# Altium project MaterBoard.PrjPcb
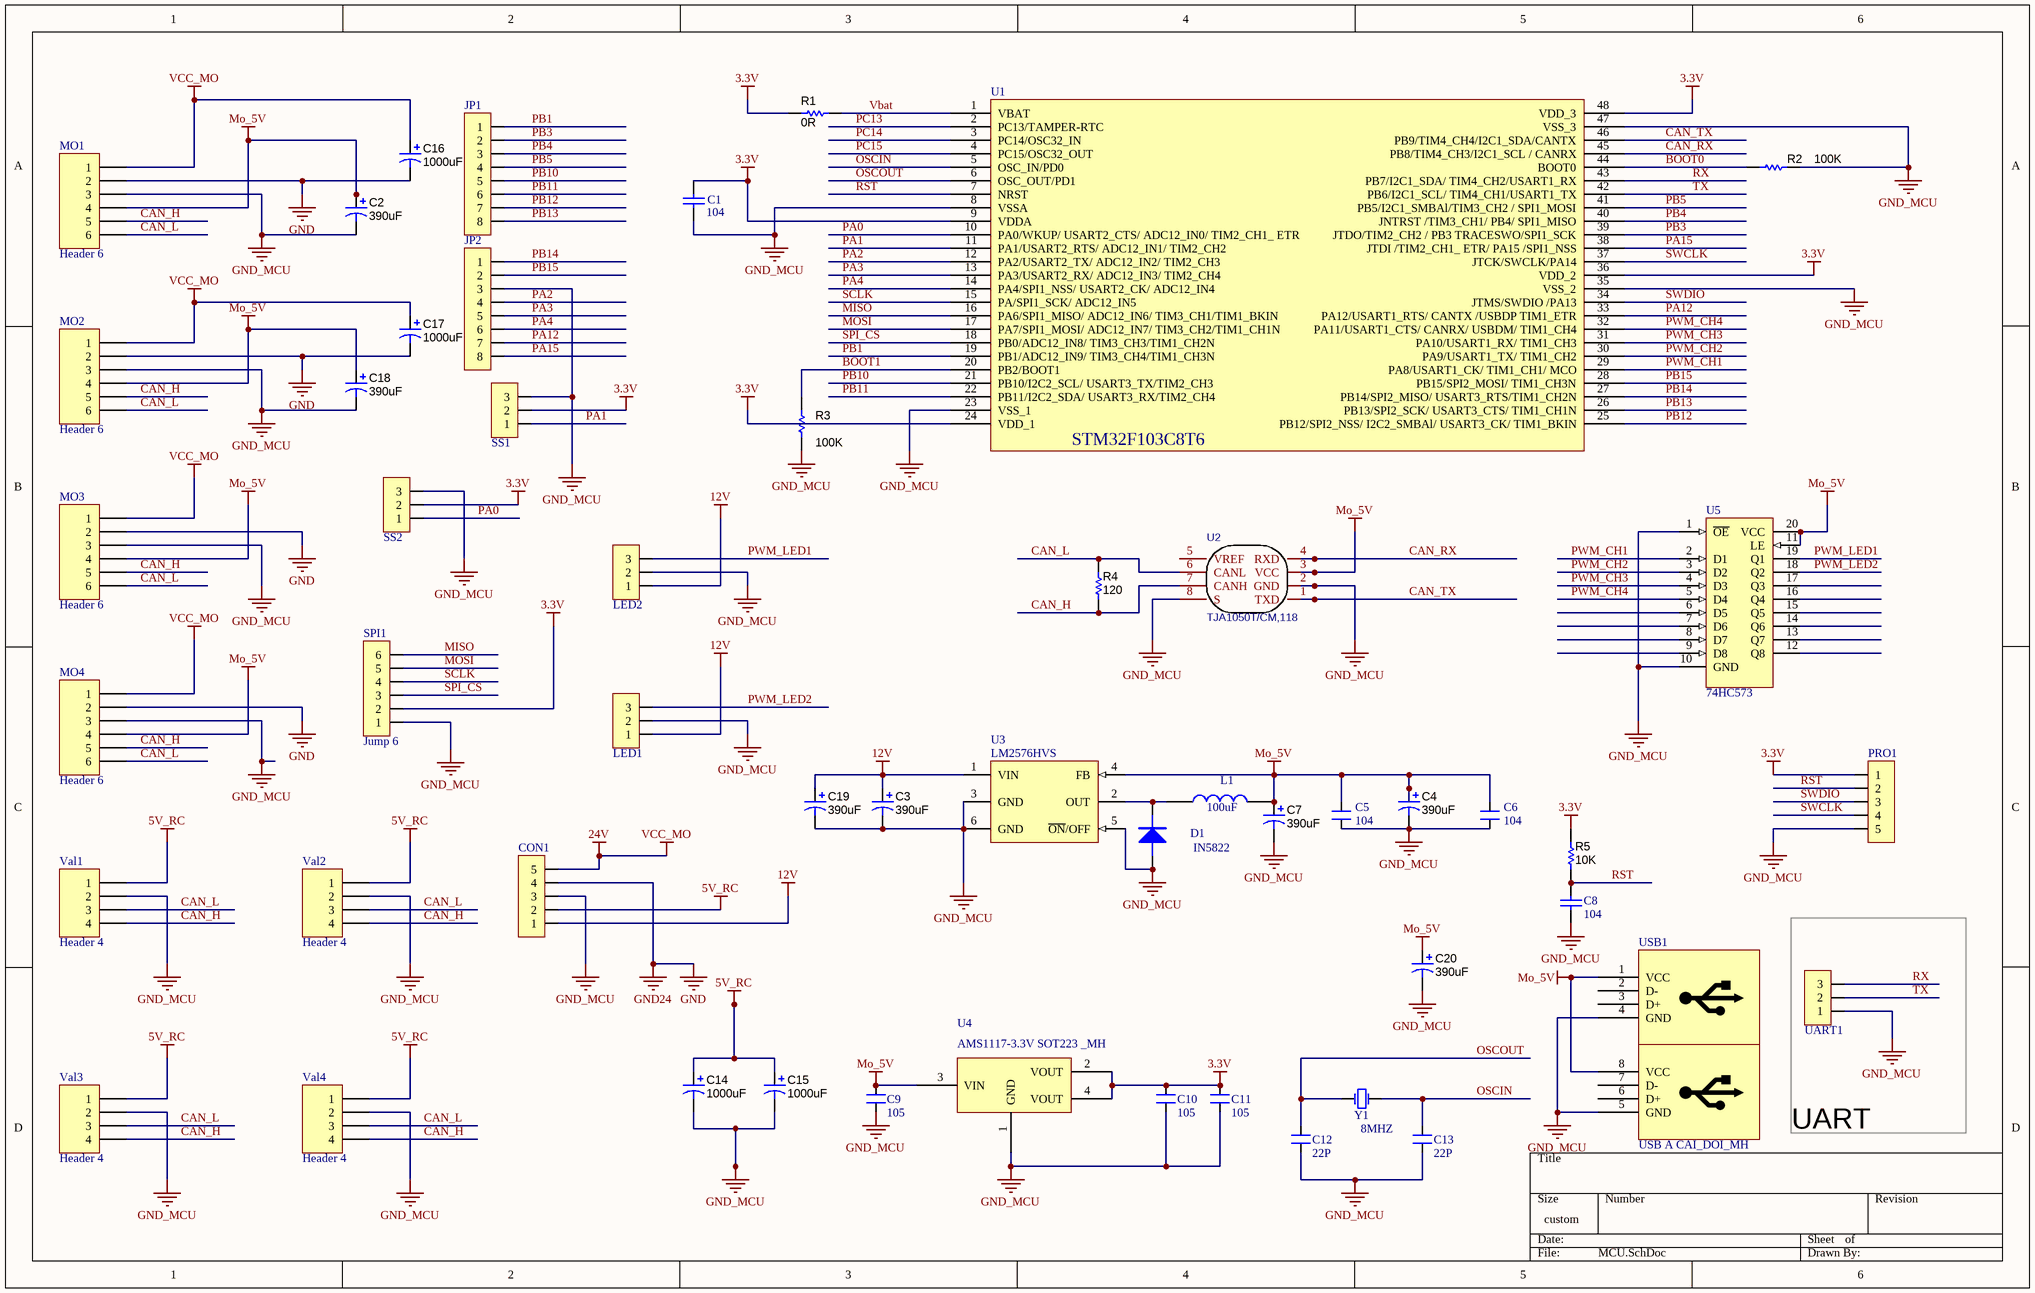
[diagram p0: MCU.SchDoc]
1 sheet, 52 parts. Net scope: global (net labels, ports and power ports of the same name join across sheets).
Board file: MasterPcb.PcbDoc

## Sheet MCU.SchDoc
size 381 x 241 mm

### Parts
C1  104  [0805_HV]
C2  390uF  [CP1/3.0]
C3  390uF  [CP1/3.0]
C4  390uF  [CP1/3.0]
C5  104  [0805_HV]
C6  104  [0805_HV]
C7  390uF  [CP1/3.0]
C8  104  [0805_HV]
C9  105  [0805_HV]
C10  105  [0805_HV]
C11  105  [0805_HV]
C12  22P  [0805_HV]
C13  22P  [0805_HV]
C14  ValueDisplayed: 1000uF  [CAP_12.5 X 25]  (hidden comment: 390uF)
C15  ValueDisplayed: 1000uF  [CAP_12.5 X 25]  (hidden comment: 390uF)
C16  ValueDisplayed: 1000uF  [CAP_12.5 X 25]  (hidden comment: 390uF)
C17  ValueDisplayed: 1000uF  [CAP_12.5 X 25]  (hidden comment: 390uF)
C18  390uF  [CP1/3.0]
C19  390uF  [CP1/3.0]
C20  390uF  [CP1/3.0]
CON1  CON 5 EDG 5.08_MH  [Con 5 EDG 5.08]  (value not drawn)
D1  IN5822  [SOD123]
JP1  Jump 8_MH  [Jump 8]  (value not drawn)
JP2  Jump 8_MH  [Jump 8]  (value not drawn)
L1  100uF  [IND_2118-V-RC]
LED1  Header 3_MH  [HEADER 3]  (value not drawn)
LED2  Header 3_MH  [HEADER 3]  (value not drawn)
MO1  Header 6  [HEADER 6]
MO2  Header 6  [HEADER 6]
MO3  Header 6  [HEADER 6]
MO4  Header 6  [HEADER 6]
PRO1  Header 5_MH  [HEADER 5]  (value not drawn)
R1  0R  [0805_HV]
R2  100K  [0805_HV]
R3  100K  [0805_HV]
R4  120  [0805_HV]
R5  10K  [0805_HV]
SPI1  Jump 6  [ZH 1.5 6P]
SS1  Header 3_MH  [HEADER 3]  (value not drawn)
SS2  Header 3_MH  [HEADER 3]  (value not drawn)
U1  STM32F103C8T6 LQFP48 _MH  [LQFP48]  (value not drawn)
U2  TJA1050T/CM,118  [SOP 8]
U3  LM2576HVS  [TO263-5]
U4  AMS1117-3.3V SOT223 _MH  [SOT223]
U5  74HC573  [SOIC-20]
UART1  Header 3_MH  [HEADER 3]  (value not drawn)
USB1  USB A CAI_DOI_MH  [USB_KEP]
Val1  Header 4  [JST-PH2.00-4P]
Val2  Header 4  [JST-PH2.00-4P]
Val3  Header 4  [JST-PH2.00-4P]
Val4  Header 4  [JST-PH2.00-4P]
Y1  8MHZ  [XT2]

### Blocks framed on the sheet
UART: UART1

### Nets
3.3V: C1.2 C10.2 C11.2 PRO1.1 R1.2 R5.2 SPI1.2 SS1.2 SS2.2 U1.9(VDDA) U1.24(VDD_1) U1.36(VDD_2) U1.48(VDD_3) U4.2(VOUT) U4.4(VOUT)
5V_RC: C14.1(+) C15.1(+) CON1.2 Val1.1 Val2.1 Val3.1 Val4.1
12V: C3.1(+) C19.1(+) CON1.1 LED1.1 LED2.1 U3.1(VIN)
24V: C16.1(+) C17.1(+) CON1.5 MO1.1 MO2.1 MO3.1 MO4.1  [also labelled VCC_MO]
GND: C16.2(-) C17.2(-) CON1.4 MO1.2 MO2.2 MO3.2 MO4.2  [also labelled GND24]
GND_MCU: C1.1 C2.2(-) C3.2(-) C4.2(-) C5.1 C6.1 C7.2(-) C8.1 C9.1 C10.1 C11.1 C12.1 C13.1 C14.2(-) C15.2(-) C18.2(-) C19.2(-) C20.2(-) CON1.3 D1.1 JP2.3 LED1.2 LED2.2 MO1.3 MO2.3 MO3.3 MO4.3 PRO1.5 R2.1 R3.2 SPI1.1 SS1.3 SS2.3 U1.8(VSSA) U1.23(VSS_1) U1.35(VSS_2) U1.47(VSS_3) U2.2(GND) U2.8(S) U3.3(GND) U3.5(~{ON}/OFF) U3.6(GND) U4.1(GND) U5.1(~{OE}) U5.10(GND) UART1.1 USB1.4(GND) USB1.5(GND) Val1.2 Val2.2 Val3.2 Val4.2
Mo_5V: C2.1(+) C4.1(+) C5.2 C6.2 C7.1(+) C9.2 C18.1(+) C20.1(+) L1.2 MO1.4 MO2.4 MO3.4 MO4.4 U2.3(VCC) U3.4(FB) U4.3(VIN) U5.11(LE) U5.20(VCC) USB1.1(VCC) USB1.8(VCC)
BOOT0: R2.2 U1.44(BOOT0)
BOOT1: R3.1 U1.20(PB2/BOOT1)
CAN_H: MO1.5 MO2.5 MO3.5 MO4.5 R4.2 U2.7(CANH) Val1.4 Val2.4 Val3.4 Val4.4
CAN_L: MO1.6 MO2.6 MO3.6 MO4.6 R4.1 U2.6(CANL) Val1.3 Val2.3 Val3.3 Val4.3
CAN_RX: U1.45(PB8/TIM4_CH3/I2C1_SCL_/_CANRX) U2.4(RXD)
CAN_TX: U1.46(PB9/TIM4_CH4/I2C1_SDA/CANTX) U2.1(TXD)
MISO: SPI1.6 U1.16(PA6/SPI1_MISO/_ADC12_IN6/_TIM3_CH1/TIM1_BKIN)
MOSI: SPI1.5 U1.17(PA7/SPI1_MOSI/_ADC12_IN7/_TIM3_CH2/TIM1_CH1N)
OSCIN: C13.2 U1.5(OSC_IN/PD0) Y1.2(OSC2)
OSCOUT: C12.2 U1.6(OSC_OUT/PD1) Y1.1(OSC1)
PA0: SS2.1 U1.10(PA0/WKUP/_USART2_CTS/_ADC12_IN0/_TIM2_CH1__ETR)
PA1: SS1.1 U1.11(PA1/USART2_RTS/_ADC12_IN1/_TIM2_CH2)
PA2: JP2.4 U1.12(PA2/USART2_TX/_ADC12_IN2/_TIM2_CH3)
PA3: JP2.5 U1.13(PA3/USART2_RX/_ADC12_IN3/_TIM2_CH4)
PA4: JP2.6 U1.14(PA4/SPI1_NSS/_USART2_CK/_ADC12_IN4)
PA12: JP2.7 U1.33(PA12/USART1_RTS/_CANTX_/USBDP_TIM1_ETR)
PA15: JP2.8 U1.38(JTDI_/TIM2_CH1__ETR/_PA15_/SPI1_NSS)
PB1: JP1.1 U1.19(PB1/ADC12_IN9/_TIM3_CH4/TIM1_CH3N)
PB3: JP1.2 U1.39(JTDO/TIM2_CH2_/_PB3_TRACESWO/SPI1_SCK)
PB4: JP1.3 U1.40(JNTRST_/TIM3_CH1/_PB4/_SPI1_MISO)
PB5: JP1.4 U1.41(PB5/I2C1_SMBAl/TIM3_CH2_/_SPI1_MOSI)
PB10: JP1.5 U1.21(PB10/I2C2_SCL/_USART3_TX/TIM2_CH3)
PB11: JP1.6 U1.22(PB11/I2C2_SDA/_USART3_RX/TIM2_CH4)
PB12: JP1.7 U1.25(PB12/SPI2_NSS/_I2C2_SMBAl/_USART3_CK/_TIM1_BKIN)
PB13: JP1.8 U1.26(PB13/SPI2_SCK/_USART3_CTS/_TIM1_CH1N)
PB14: JP2.1 U1.27(PB14/SPI2_MISO/_USART3_RTS/TIM1_CH2N)
PB15: JP2.2 U1.28(PB15/SPI2_MOSI/_TIM1_CH3N)
PC13: U1.2(PC13/TAMPER-RTC)
PC14: U1.3(PC14/OSC32_IN)
PC15: U1.4(PC15/OSC32_OUT)
PWM_CH1: U1.29(PA8/USART1_CK/_TIM1_CH1/_MCO) U5.2(D1)
PWM_CH2: U1.30(PA9/USART1_TX/_TIM1_CH2) U5.3(D2)
PWM_CH3: U1.31(PA10/USART1_RX/_TIM1_CH3) U5.4(D3)
PWM_CH4: U1.32(PA11/USART1_CTS/_CANRX/_USBDM/_TIM1_CH4) U5.5(D4)
PWM_LED1: LED2.3 U5.19(Q1)
PWM_LED2: LED1.3 U5.18(Q2)
RST: C8.2 PRO1.2 R5.1 U1.7(NRST)
RX: U1.43(PB7/I2C1_SDA/_TIM4_CH2/USART1_RX) UART1.3
SCLK: SPI1.4 U1.15(PA/SPI1_SCK/_ADC12_IN5)
SPI_CS: SPI1.3 U1.18(PB0/ADC12_IN8/_TIM3_CH3/TIM1_CH2N)
SWCLK: PRO1.4 U1.37(JTCK/SWCLK/PA14)
SWDIO: PRO1.3 U1.34(JTMS/SWDIO_/PA13)
TX: U1.42(PB6/I2C1_SCL/_TIM4_CH1/USART1_TX) UART1.2
Vbat: R1.1 U1.1(VBAT)
NetD1_2: D1.2 L1.1 U3.2(OUT)

Not connected (* = marked no-connect by the designer): U2 5(VREF); U5 6(D5) 7(D6) 8(D7) 9(D8) 12(Q8) 13(Q7) 14(Q6) 15(Q5) 16(Q4) 17(Q3); USB1 2(D-) 3(D+) 6(D+) 7(D-)

### Notes on the sheet
- (in symbol STM32F103C8T6 LQFP48 _MH) STM32F103C8T6

### Library data of the parts
C1 C8 = Capacitor 0805: Ceramic Chip Capacitor - Standard; Note: Footprint corresponds to dimensions for bulk cassette packaging. This case size has tightened tolerances.; Published: 17-Jul-2002; LatestRevisionDate: 19-Mar-2004; LatestRevisionNote: Silkscreen size reduced.; DatasheetDocument: Mar-2001; PackageDocument: Mar-2001; PackageReference: 0805; Publisher: Altium Limited; Code_JEITA: 0805; Code_IPC: 2012[0805]; ComponentLink1Description: Manufacturer Link; ComponentLink1URL: http://www.kemet.com/; ComponentLink2Description: Datasheet; ComponentLink2URL: http://www.kemet.com/kemet/web/homepage/kechome.nsf/vapubfilesname/F3102TA.pdf/$file/F3102TA.pdf; Value: 104
C2-C4 C7 C18-C20 = Capacitor TuHoa: PartNumber: UHW1H391MPD6; Manufacturer: Nichicon; Polarized: Y; U/M: EA; Cap_F: 0.000390; Tolerance_%: 20; Value1: Unknown; VDC_V: 50; Value2: 50V; TaMin_C: -40; TaMax_C: 105; Cap_Case: 10x22; AEC Category: Q200; AEC Qualified: N; CompType: Capacitor; SymbolVersion: 2008-07-09; Value: 390uF; PackageReference: 10x22; RoHS: Y; MountType: TH; Technology: AL; Series: ZL; Publisher: Texas Instruments; LatestRevisionDate: 2015-12-17; ComponentLink1Description: Datasheet link; ComponentLink1URL: http://nichicon-us.com/english/products/pdfs/e-uhw.pdf; Supplier 1: Digi-Key; Supplier Part Number 1: 493-6885-ND; AEC Grade: N/A; ValueDisplayed: 390uF
C5 C6 C9-C13 = CM: Cap SMD; Value: 103
C14-C17 = Capacitor TuHoa: CAP ALUM 390UF 20% 50V RADIAL; PartNumber: UHW1H391MPD6; Manufacturer: Nichicon; Polarized: Y; U/M: EA; Cap_F: 0.000390; Tolerance_%: 20; Value1: Unknown; VDC_V: 50; TaMin_C: -40; TaMax_C: 105; Cap_Case: 10x22; AEC Category: Q200; AEC Qualified: N; CompType: Capacitor; SymbolVersion: 2008-07-09; Value: 390uF; PackageReference: 10x22; RoHS: Y; Value2: 50V; MountType: TH; Technology: AL; Series: ZL; Publisher: Texas Instruments; LatestRevisionDate: 2015-12-17; ComponentLink1Description: Datasheet link; ComponentLink1URL: http://nichicon-us.com/english/products/pdfs/e-uhw.pdf; Supplier 1: Digi-Key; Supplier Part Number 1: 493-6885-ND; AEC Grade: N/A
CON1 = CON 5 EDG 5.08_MH: CON 5 EDG 5.08 (xanh cong)
D1 = Diode S4 SOD123 ( 1N5819 SOD123)_MH: Diode S4 SOD123 ( 1N5819 SOD123)
JP1 JP2 = Jump 8_MH: Jump 8P 2.54
L1 = Inductor Lm2576_MH: cuon cam
LED1 LED2 SS1 SS2 UART1 = Header 3_MH: Header 3P XH2.54 thẳng
MO1-MO4 = Header 6: Header, 6-Pin; LatestRevisionDate: 17-Jul-2002; LatestRevisionNote: Re-released for DXP Platform.; Publisher: Altium Limited
PRO1 = Header 5_MH: Header 5P XH2.54 thẳng
R1-R5 = R nho: RES, 100, 1%, 0.1 W, 0402; PartNumber: ERJ-2RKF1000X; Manufacturer: Panasonic; CompType: Resistor; Res_ohm: 100; Value_Code: 100R; Tolerance_%: 1; Power_W: 0.1; Value2: 0.1W; VDC_V: 50; TempCo: 100 ppm/C; EIA_Code: E96; U/M: EA; AEC Category: Q200; SymbolVersion: 2009-05-29; PackageReference: 0402; RoHS: Y; Value1: 1%; MountType: SMT; Technology: Thick Film; Published: 2008-06-26; Publisher: Texas Instruments; LatestRevisionDate: 2016-01-08; ComponentLink1Description: Datasheet link; ComponentLink1URL: http://industrial.panasonic.com/www-data/pdf/AOA0000/AOA0000CE2.pdf; Supplier 1: Digi-Key; Supplier Part Number 1: P100LCT-ND; Supplier 2: Mouser; Supplier Part Number 2: 667-ERJ-2RKF1000X; Supplier 3: Farnell; Supplier Part Number 3: 2304034; AEC Qualified: ?
  R1: Value: 0R
  R2 R3: Value: 100K
  R4: Value: 120
  R5: Value: 10K
SPI1 = Jump 6: Jump 6P 2.54
U2 = TJA1050T/CM,118: BOM_Manufacturer: NXP; SMT Type: Basic; BOM_Supplier: LCSC; BOM_Manufacturer Part: TJA1050T/CM,118; BOM_LCSC Assembly: Yes; image: //image.lceda.cn/szlcsc/C6952.jpg; BOM_Supplier Part: C6952; spicePre: U
U3 = LM2576HVS-5.0V BUCK 5V 3A TO263-5 _MH: PartNumber: LM2576T-5.0; Manufacturer: National Semiconductor; CompType: Switcher; PackageTopMarking: NSUZXYTT*LM2576T*-5.0 P+; PowerWise: N; FirstPublished: 4-Dec-2008; DatasheetVersion: Aug-2004; PackageVersion: revJ, Jan-1992; PackageReference: T05A; Publisher: Altium Limited; PackageDescription: TO-220, Molded, 5 Lead, Straight; RoHS: O; PinCount: 5; DigiKeyPartNumber: LM2576T-5.0-ND; Code_JEDEC: TO-220-AB; ComponentLink1Description: LM2576 Datasheet; ComponentLink1URL: http://www.national.com/ds/LM/LM2576.pdf; ComponentLink2Description: LM2576 Web Page; ComponentLink2URL: http://www.national.com/pf/LM/LM2576.html; ComponentLink3Description: T05A Package Page; ComponentLink3URL: http://www.national.com/packaging/folders/t05a.html
U5 = 74HC573 DIP20 IC Flip-Flop_MH: Octal D-Type Latch with 3-State Output Non-Inverting; Value: 74HC573; Copyright by: VanDungEvn@Gmail.com
Val1-Val4 = Header 4: Header, 4-Pin; LatestRevisionDate: 17-Jul-2002; LatestRevisionNote: Re-released for DXP Platform.; Publisher: Altium Limited
Y1 = CRYSTAL_49S DIP_MH: Crystal Oscillator; Published: 8-Jun-2000; LatestRevisionDate: 17-Jul-2002; LatestRevisionNote: Re-released for DXP Platform.; PackageReference: R38; Publisher: Altium Limited